# EAGLE design RHD2216_Adapter (EAGLE 6.3)
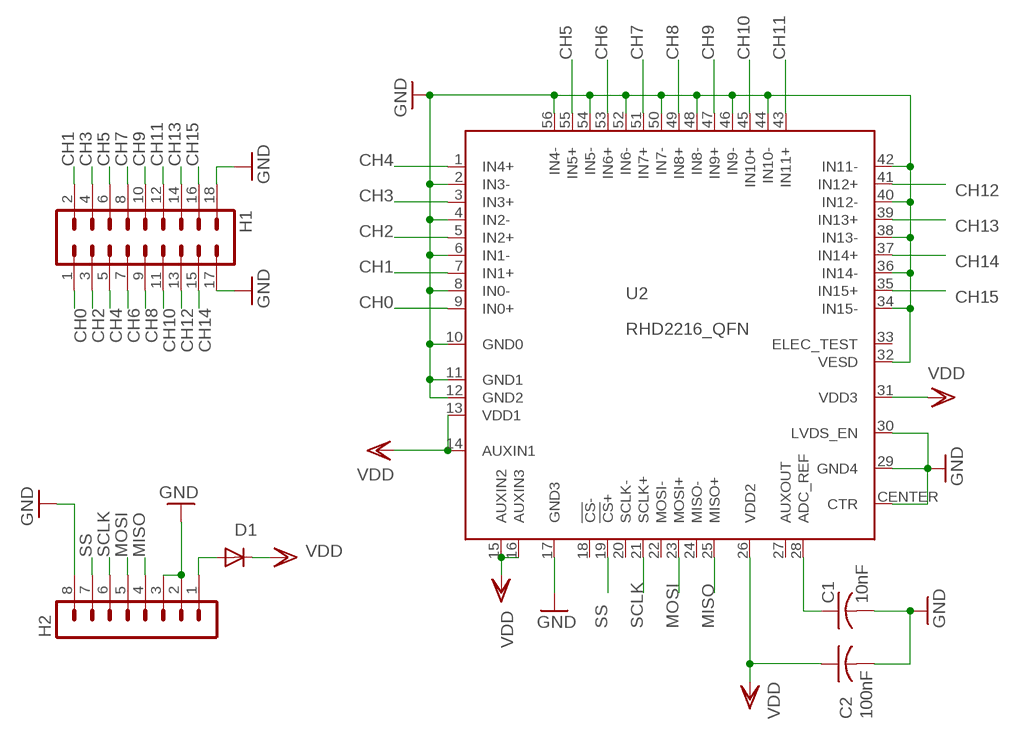
[diagram p0: schematic, sheet 1]

## Parts
C1  10nF  C-USC0402  [C0402]
C2  100nF  C-USC0402  [C0402]
D1  DIODE-DO214BA  [DO214BA]
H1  MA09-2W  [MA09-2W]
H2  MA08-1W  [MA08-1W]
U2  RHD2216_QFN  [QFN56_8_X_8_LARGE]

## Nets
CH0: H1.1 U2.9(IN0+)
CH1: H1.2 U2.7(IN1+)
CH2: H1.3 U2.5(IN2+)
CH3: H1.4 U2.3(IN3+)
CH4: H1.5 U2.1(IN4+)
CH5: H1.6 U2.55(IN5+)
CH6: H1.7 U2.53(IN6+)
CH7: H1.8 U2.51(IN7+)
CH8: H1.9 U2.49(IN8+)
CH9: H1.10 U2.47(IN9+)
CH10: H1.11 U2.45(IN10+)
CH11: H1.12 U2.43(IN11+)
CH12: H1.13 U2.41(IN12+)
CH13: H1.14 U2.39(IN13+)
CH14: H1.15 U2.37(IN14+)
CH15: H1.16 U2.35(IN15+)
GND: C1.2 C2.2 H1.17 H1.18 H2.2 H2.3 H2.8 U2.2(IN3-) U2.4(IN2-) U2.6(IN1-) U2.8(IN0-) U2.10(GND0) U2.11(GND1) U2.12(GND2) U2.17(GND3) U2.29(GND4) U2.30(LVDS_EN) U2.32(VESD) U2.34(IN15-) U2.36(IN14-) U2.38(IN13-) U2.40(IN12-) U2.42(IN11-) U2.44(IN10-) U2.46(IN9-) U2.48(IN8-) U2.50(IN7-) U2.52(IN6-) U2.54(IN5-) U2.56(IN4-) U2.CENTER(CTR)
MISO: H2.4 U2.25(MISO+)
MOSI: H2.5 U2.23(MOSI+)
N$1: D1.A H2.1
N$4: C1.1 U2.28(ADC_REF)
SCLK: H2.6 U2.21(SCLK+)
SS: H2.7 U2.19(!CS!+)
VDD: C2.1 D1.C U2.13(VDD1) U2.14(AUXIN1) U2.15(AUXIN2) U2.16(AUXIN3) U2.26(VDD2) U2.31(VDD3)
Unconnected: U2.18(!CS!-) U2.20(SCLK-) U2.22(MOSI-) U2.24(MISO-) U2.27(AUXOUT) U2.33(ELEC_TEST)

## Library data of the parts
C1 C2 = rcl:C-US: CAPACITOR, American symbol
D1 = diode:DIODE-: DIODE
H1 = con-lstb:MA09-2W: PIN HEADER; OC_FARNELL: unknown; OC_NEWARK: unknown
H2 = con-lstb:MA08-1W: PIN HEADER; OC_FARNELL: unknown; OC_NEWARK: unknown
U2 = RHD2000:RHD2216

## Board
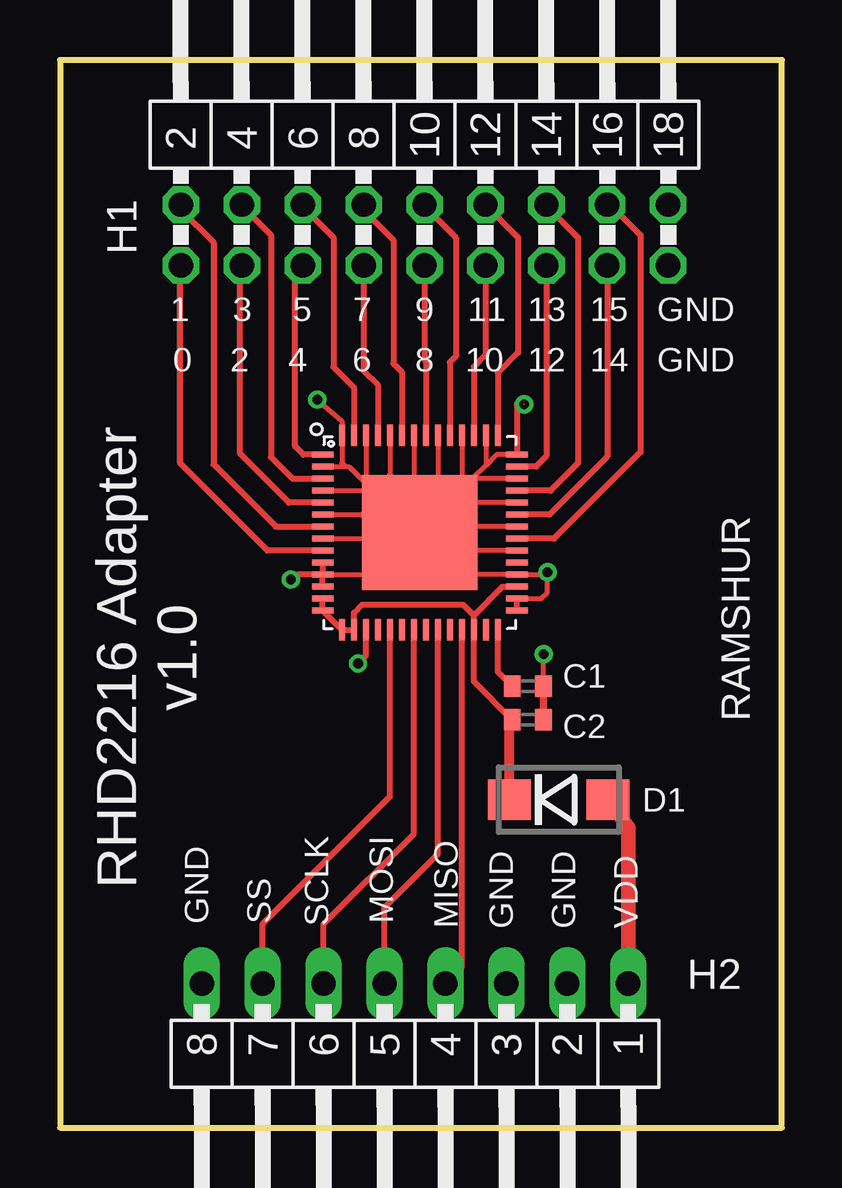
[diagram p1: board, top side]
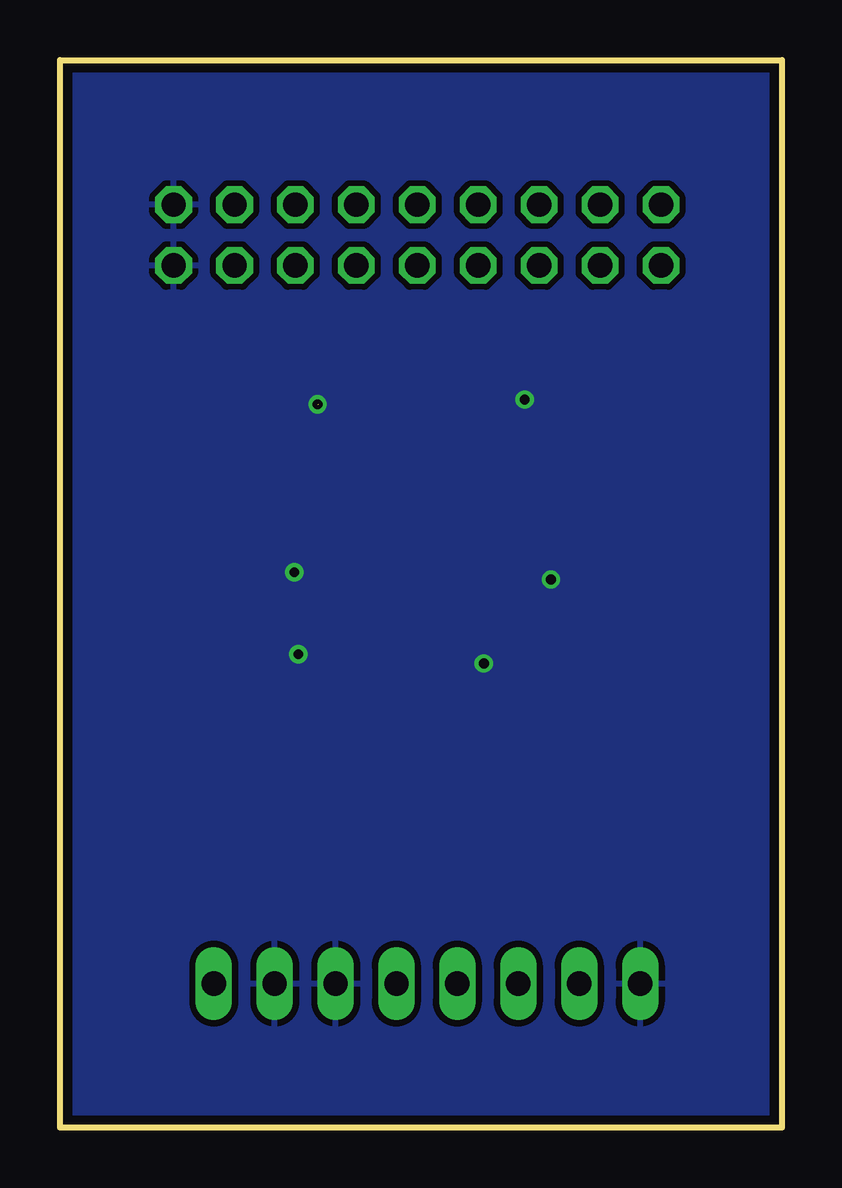
[diagram p2: board, bottom side, seen from below]

Size 30.1 x 44.5 mm. Coordinates in mm from the lower left corner, seen from the top.
Outline: 0,0 30.1,0 30.1,44.5 0,44.5 0,0
Copper layers (1*16): Top 0.0356mm / dielectric 1.5011mm / Bottom 0.0356mm
Design rules "LaenPCBOrder": minimum track width 6mil, minimum drill 13mil, track to track 6mil, track to pad 6mil, pad to pad 6mil, via to via 6mil, smd to smd 6mil, copper to edge 15mil, drill to drill 6mil, minimum pad ring 7mil, minimum via ring 7mil, stop-mask expansion 4mil, vias tented up to drill 0mil, thermal gap 10mil

### Footprints (pad centres in the part's own frame; a part is rotated, then mirrored left to right if it is on the bottom)
C0402 = smd 0.7 x 0.9: 1 -0.65,0; 2 0.65,0
DO214BA = smd 1.8 x 1.7: A 2.05,0; C -2.05,0
MA09-2W = drill 1.016 octagon: 1 -10.16,-1.27; 2 -10.16,1.27; 3 -7.62,-1.27; 4 -7.62,1.27; 5 -5.08,-1.27; 6 -5.08,1.27; 7 -2.54,-1.27; 8 -2.54,1.27; 9 0,-1.27; 10 0,1.27; 11 2.54,-1.27; 12 2.54,1.27; 13 5.08,-1.27; 14 5.08,1.27; 15 7.62,-1.27; 16 7.62,1.27; 17 10.16,-1.27; 18 10.16,1.27
MA08-1W = drill 1.016 long: 1 -8.89,0; 2 -6.35,0; 3 -3.81,0; 4 -1.27,0; 5 1.27,0; 6 3.81,0; 7 6.35,0; 8 8.89,0
QFN56_8_X_8_LARGE = smd 0.9 x 0.25: 1 -4.05,3.25; 2 -4.05,2.75; 3 -4.05,2.25; 4 -4.05,1.75; 5 -4.05,1.25; 6 -4.05,0.75; 7 -4.05,0.25; 8 -4.05,-0.25; 9 -4.05,-0.75; 10 -4.05,-1.25; 11 -4.05,-1.75; 12 -4.05,-2.25; 13 -4.05,-2.75; 14 -4.05,-3.25; 29 4.05,-3.25; 30 4.05,-2.75; 31 4.05,-2.25; 32 4.05,-1.75; 33 4.05,-1.25; 34 4.05,-0.75; 35 4.05,-0.25; 36 4.05,0.25; 37 4.05,0.75; 38 4.05,1.25; 39 4.05,1.75; 40 4.05,2.25; 41 4.05,2.75; 42 4.05,3.25 | smd 0.25 x 0.9: 15 -3.25,-4.05; 16 -2.75,-4.05; 17 -2.25,-4.05; 18 -1.75,-4.05; 19 -1.25,-4.05; 20 -0.75,-4.05; 21 -0.25,-4.05; 22 0.25,-4.05; 23 0.75,-4.05; 24 1.25,-4.05; 25 1.75,-4.05; 26 2.25,-4.05; 27 2.75,-4.05; 28 3.25,-4.05; 43 3.25,4.05; 44 2.75,4.05; 45 2.25,4.05; 46 1.75,4.05; 47 1.25,4.05; 48 0.75,4.05; 49 0.25,4.05; 50 -0.25,4.05; 51 -0.75,4.05; 52 -1.25,4.05; 53 -1.75,4.05; 54 -2.25,4.05; 55 -2.75,4.05; 56 -3.25,4.05 | smd 4.8 x 4.8: CENTER 0,0

### Placement (x,y rotation side)
C1  19.5,18.4 0 top
C2  19.5,17 0 top
D1  20.79,13.67 0 top
H1  15.2,37.2 0 top
H2  14.8,6 180 top
U2  15,24.8 0 top

### Tracks (layer width: path | path; a pad name or v marks a point on that pad's centre or on a via)
CH0
  Top 0.254: U2.9 8.65,24.05 5,27.7 5,35.89
  Top 0.305: 5,35.89 H1.1
CH1
  Top 0.254: 5.04,38.26 6.4,36.9 6.4,27.65 9,25.05 U2.7
  Top 0.305: H1.2 5.04,38.26
CH2
  Top 0.254: U2.5 9.55,26.05 7.5,28.1 7.5,35.85
  Top 0.305: 7.5,35.85 H1.3
CH3
  Top 0.254: 7.58,38.42 8.8,37.2 8.8,27.95 9.7,27.05 U2.3
  Top 0.305: H1.4 7.58,38.42
CH4
  Top 0.254: U2.1 10.15,28.05 9.8,28.4 9.8,35.61 H1.5
CH5
  Top 0.254: 10.12,38.38 11.4,37.1 11.4,31.7 12.25,30.85 U2.55
  Top 0.305: H1.6 10.12,38.38
CH6
  Top 0.254: H1.7 12.66,31.54 13.25,30.95 U2.53
CH7
  Top 0.254: H1.8 12.66,38.24 13.9,37 13.9,31.85 14.25,31.5 U2.51
CH8
  Top 0.254: H1.9 15.2,32 15.25,31.95 U2.49
CH9
  Top 0.254: H1.10 15.2,38.4 16.5,37.1 16.5,32.15 16.25,31.9 U2.47
CH10
  Top 0.254: H1.11 17.74,32.19 17.25,31.7 U2.45
CH11
  Top 0.254: H1.12 19.1,37.1 19.1,32.3 18.25,31.45 U2.43
CH12
  Top 0.254: H1.13 20.28,27.98 19.85,27.55 U2.41
CH13
  Top 0.254: H1.14 20.28,38.42 21.6,37.1 21.6,27.7 20.45,26.55 U2.39
CH14
  Top 0.254: H1.15 22.82,27.97 20.4,25.55 U2.37
CH15
  Top 0.254: H1.16 22.93,38.47 24.2,37.2 24.2,28.15 20.6,24.55 U2.35
GND  (via drill 0.41)  (1 unrouted)
  Top 0.2: 20.33,23.05 U2.32 17.2,23.05 17.2,23.8 17,24 | U2.34 17,24.05 | U2.36 17.1,25.05 17.1,25.06 | U2.38 17.1,26.05 | U2.40 17.2,27.05 | U2.42 18.2,28.05 17.75,27.6 | U2.44 17.75,27.6 | 17.75,27.6 17.2,27.05 | U2.46 16.75,27.05 17.2,27.05 | U2.48 15.75,26.95 | U2.50 14.75,27.05 13.95,27.05 13.9,27 | U2.52 13.75,27.15 13.1,26.5 | U2.54 12.75,27.05 | U2.2 11.9,27.55 | 11.9,27.55 12.05,27.55 12.95,26.65 12.95,26.85 12.8,27 | 11.9,27.55 11.75,27.7 U2.56 11.75,29.45 v10.73,30.35 | U2.4 12.72,26.55 | 12.72,26.55 12.85,26.55 | 12.65,25.55 U2.6 12.72,25.55 12.72,26.55 | U2.8 12.75,24.55 | U2.11 13.1,23.05 | U2.30 20.06,22.05 20.31,22.3 20.31,23.13 v20.33,23.15 | 17.1,25.06 17.11,25.06 17.1,25.07 17.1,25.1 17.1,26 17.1,26.4 16.6,26.9 15.8,26.9 | U2.CENTER 16.84,24.8 17.1,25.06 | 12.8,24.6 12.8,25.4 12.7,25.5 | C1.2 20.15,18.27 v20.16,19.73
  Top 0.254: U2.29 U2.30 | 19.33,30.15 19.05,30.15 U2.42 | v12.43,19.35 12.75,19.67 U2.17 | U2.12 U2.11 U2.10 10.95,23.15 10.9,23.05 9.88,23.05 v9.63,22.85
  Top 0.305: C2.2 C1.2 | 20.33,23.05 v20.33,23.15 | 17.2,23.05 17.2,23 | 17,24.05 17,24 | 17.1,25.05 17.1,25.1 | 17.1,26.05 17.1,26 | 17.2,27.05 17.2,26.9 | 16.75,27.05 arc-90 16.6,26.9 | 15.75,26.95 arc90 15.8,26.9 | 14.75,27.05 arc90 14.8,27 | 13.75,27.15 arc90 13.9,27 | 12.75,27.05 arc90 12.8,27 | 13.1,26.5 12.95,26.65 12.85,26.55 | 12.65,25.55 12.7,25.5 | 12.75,24.55 12.8,24.6
  other vias: 19.36,30.14
  pour Bottom (isolate 0.254): 0.5,44 29.6,44 29.6,0.5 0.5,0.5
MISO
  Top 0.254: H2.4 16.75,6.68 U2.25
MOSI
  Top 0.254: H2.5 13.53,9.18 15.75,11.4 U2.23
N$1
  Top 0.61: H2.1 23.69,12.52 D1.A
N$4
  Top 0.254: C1.1 18.25,19 U2.28
SCLK
  Top 0.254: H2.6 10.99,8.49 14.75,12.25 U2.21
SS
  Top 0.254: H2.7 8.45,8.5 13.75,13.8 U2.19
VDD
  Top 0.254: C2.1 17.25,18.6 U2.26 17.25,21.35 | 17.25,21.35 18.45,22.55 U2.31 | U2.13 U2.14 U2.15 U2.16 12.25,21.45 12.6,21.8 16.8,21.8 17.25,21.35
  Top 0.406: D1.C 18.74,16.89 C2.1

### Text on the board
tNames: 1 | 3 | 5 | 7 | 9 | 11 | 13 | 15 | GND | 0 | 2 | 4 | 6 | 8 | 10 | 12 | 14 | GND | RAMSHUR | RHD2216 Adapter / v1.0 | GND | SS | SCLK | MOSI | MISO | GND | GND | VDD